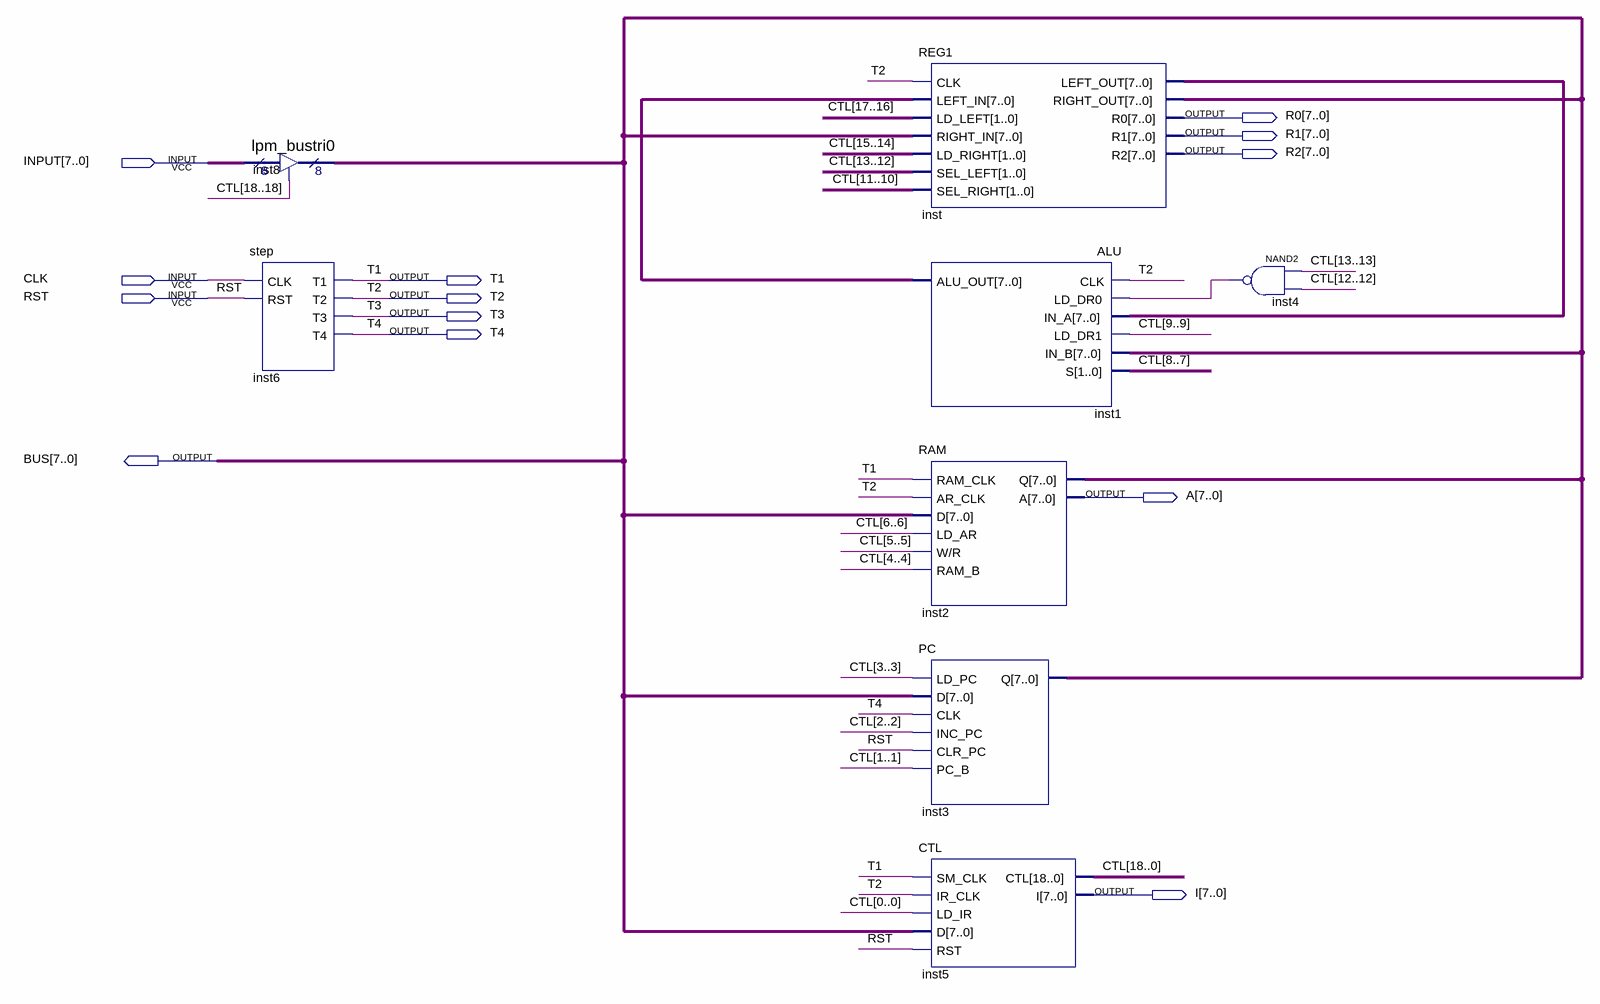
[diagram p0: schematic sheet]
// Quartus schematic MODEL8.bdf as structural Verilog: 8 symbols, 13 pins
module MODEL8 (
  input  [7:0] INPUT,
  input  CLK,
  input  RST,
  output [7:0] R0,
  output [7:0] R1,
  output [7:0] R2,
  output T1,
  output T2,
  output T3,
  output T4,
  output [7:0] BUS,
  output [7:0] A,
  output [7:0] I
);

  wire inst4_out;
  wire [7:0] inst1_alu_out, inst_left_out;
  wire [18:0] CTL;

  lpm_bustri0 inst8 (.enabledt(CTL[18]), .data(INPUT), .tridata(BUS));
  step inst6 (.CLK(CLK), .RST(RST), .T1(T1), .T2(T2), .T3(T3), .T4(T4));
  REG1 inst (
    .CLK(T2), .LEFT_IN(inst1_alu_out), .LD_LEFT(CTL[17:16]), .RIGHT_IN(BUS), .LD_RIGHT(CTL[15:14]),
    .SEL_LEFT(CTL[13:12]), .SEL_RIGHT(CTL[11:10]), .LEFT_OUT(inst_left_out), .RIGHT_OUT(BUS), .R0(R0),
    .R1(R1), .R2(R2));
  ALU inst1 (
    .CLK(T2), .LD_DR0(inst4_out), .IN_A(inst_left_out), .LD_DR1(CTL[9]), .IN_B(BUS), .S(CTL[8:7]),
    .ALU_OUT(inst1_alu_out));
  RAM inst2 (.RAM_CLK(T1), .AR_CLK(T2), .D(BUS), .LD_AR(CTL[6]), .\W/R (CTL[5]), .RAM_B(CTL[4]), .Q(BUS), .A(A));
  PC inst3 (.LD_PC(CTL[3]), .D(BUS), .CLK(T4), .INC_PC(CTL[2]), .CLR_PC(RST), .PC_B(CTL[1]), .Q(BUS));
  CTL inst5 (.SM_CLK(T1), .IR_CLK(T2), .LD_IR(CTL[0]), .D(BUS), .RST(RST), .CTL(CTL), .I(I));
  nand inst4 (inst4_out, CTL[13], CTL[12]);
endmodule
